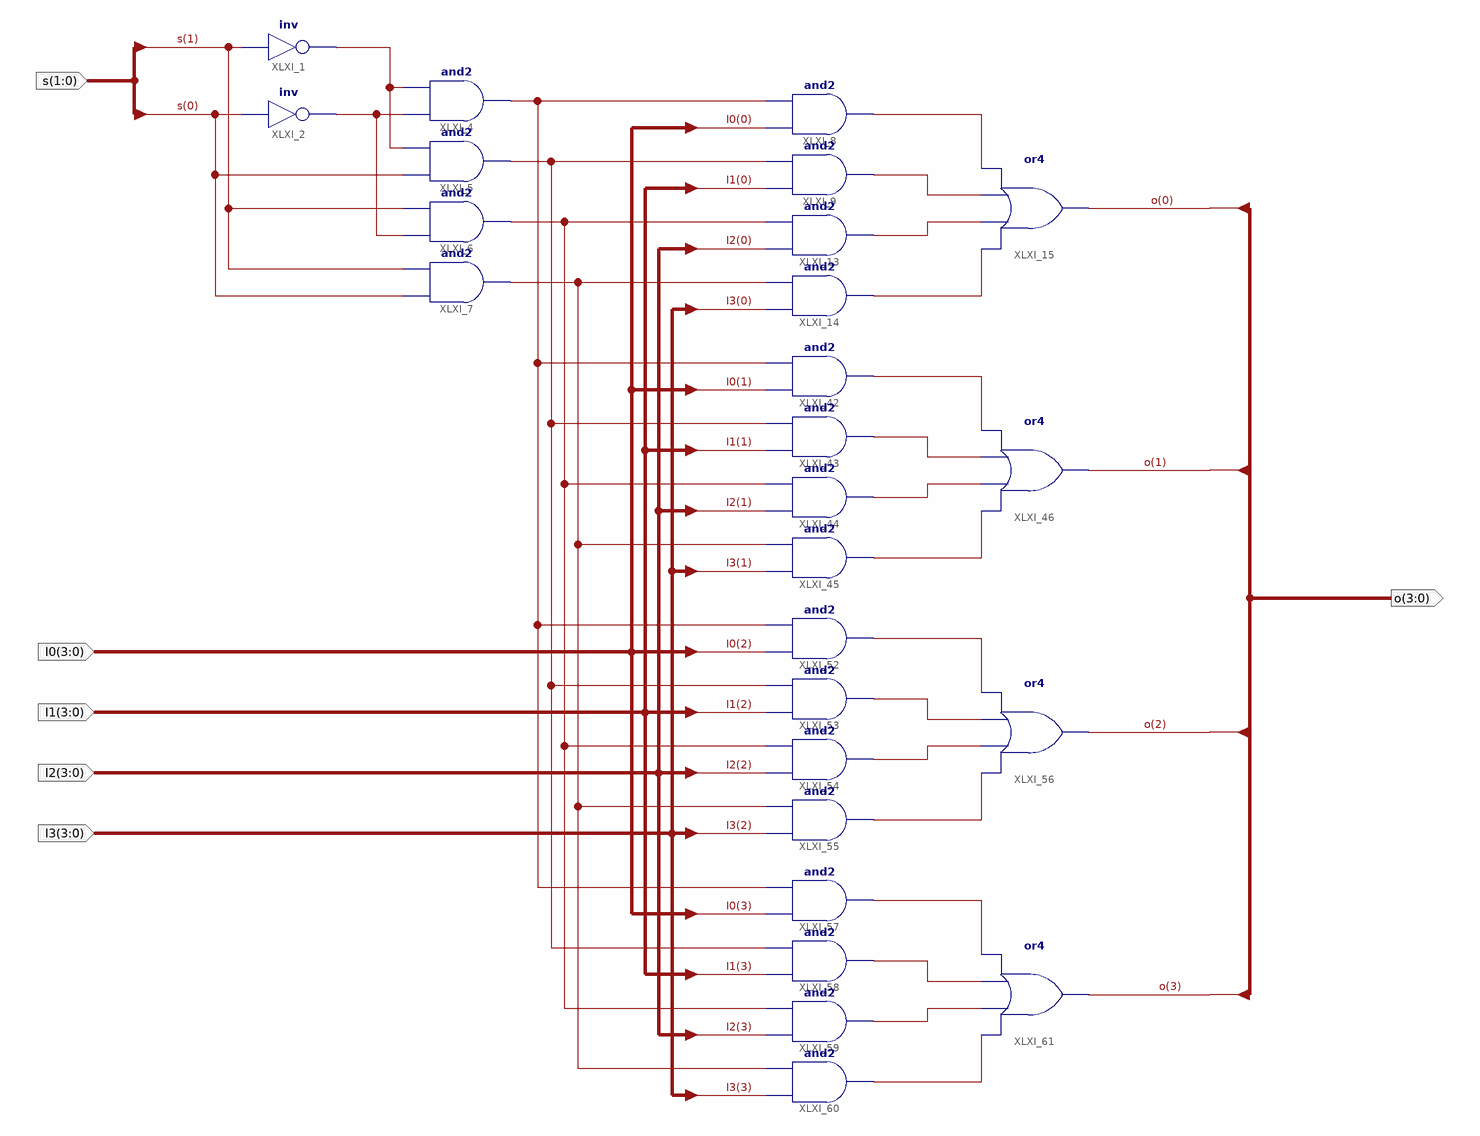
[diagram p0: schematic sheet 1]
// Xilinx ISE schematic MUX4T1_4.sch (kintex7) as structural Verilog: 26 symbols, 6 ports
module MUX4T1_4 (
  input  [1:0] s,
  input  [3:0] I1,
  input  [3:0] I0,
  input  [3:0] I2,
  input  [3:0] I3,
  output [3:0] o
);

  wire XLXN_4, XLXN_5, XLXN_39, XLXN_40, XLXN_41, XLXN_42, XLXN_72, XLXN_73, XLXN_74, XLXN_75, XLXN_82,
       XLXN_83, XLXN_84, XLXN_85, XLXN_87, XLXN_88, XLXN_89, XLXN_90, XLXN_161, XLXN_163, XLXN_164, XLXN_165;

  and XLXI_8 (XLXN_39, I0[0], XLXN_161);
  and XLXI_9 (XLXN_40, I1[0], XLXN_163);
  and XLXI_13 (XLXN_41, I2[0], XLXN_164);
  and XLXI_14 (XLXN_42, I3[0], XLXN_165);
  or XLXI_15 (o[0], XLXN_42, XLXN_41, XLXN_40, XLXN_39);
  and XLXI_42 (XLXN_72, I0[1], XLXN_161);
  and XLXI_43 (XLXN_73, I1[1], XLXN_163);
  and XLXI_44 (XLXN_74, I2[1], XLXN_164);
  and XLXI_45 (XLXN_75, I3[1], XLXN_165);
  or XLXI_46 (o[1], XLXN_75, XLXN_74, XLXN_73, XLXN_72);
  and XLXI_52 (XLXN_82, I0[2], XLXN_161);
  and XLXI_53 (XLXN_83, I1[2], XLXN_163);
  and XLXI_54 (XLXN_84, I2[2], XLXN_164);
  and XLXI_55 (XLXN_85, I3[2], XLXN_165);
  or XLXI_56 (o[2], XLXN_85, XLXN_84, XLXN_83, XLXN_82);
  and XLXI_57 (XLXN_87, I0[3], XLXN_161);
  and XLXI_58 (XLXN_88, I1[3], XLXN_163);
  and XLXI_59 (XLXN_89, I2[3], XLXN_164);
  and XLXI_60 (XLXN_90, I3[3], XLXN_165);
  or XLXI_61 (o[3], XLXN_90, XLXN_89, XLXN_88, XLXN_87);
  not XLXI_1 (XLXN_4, s[1]);
  not XLXI_2 (XLXN_5, s[0]);
  and XLXI_4 (XLXN_161, XLXN_5, XLXN_4);
  and XLXI_5 (XLXN_163, s[0], XLXN_4);
  and XLXI_6 (XLXN_164, XLXN_5, s[1]);
  and XLXI_7 (XLXN_165, s[0], s[1]);
endmodule
